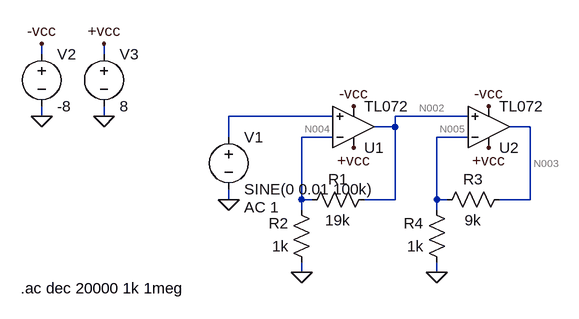
[diagram p0: schematic Bandwidth_OpAmp.asc]
Bandwidth_OpAmp.asc, the LTspice schematic file:
Version 4
SHEET 1 880 680
WIRE -160 0 -160 -16
WIRE -64 0 -64 -16
WIRE -160 96 -160 80
WIRE -64 96 -64 80
WIRE 288 96 128 96
WIRE 496 96 384 96
WIRE 384 112 384 96
WIRE 384 112 352 112
WIRE 592 112 560 112
WIRE 128 128 128 96
WIRE 288 128 240 128
WIRE 496 128 448 128
WIRE 128 224 128 208
WIRE 240 224 240 128
WIRE 256 224 240 224
WIRE 384 224 384 112
WIRE 384 224 336 224
WIRE 448 224 448 128
WIRE 464 224 448 224
WIRE 592 224 592 112
WIRE 592 224 544 224
WIRE 240 240 240 224
WIRE 448 240 448 224
WIRE 240 336 240 320
WIRE 448 336 448 320
FLAG 240 336 0
FLAG 128 224 0
FLAG -160 96 0
FLAG -64 96 0
FLAG -64 -16 +vcc
FLAG 320 144 +vcc
FLAG 320 80 -vcc
FLAG -160 -16 -vcc
FLAG 448 336 0
FLAG 528 144 +vcc
FLAG 528 80 -vcc
SYMBOL voltage 128 112 R0
WINDOW 123 24 124 Left 2
WINDOW 39 0 0 Left 0
SYMATTR Value2 AC 1
SYMATTR InstName V1
SYMATTR Value SINE(0 0.01 100k)
SYMBOL OpAmps\\TL072 320 176 M180
SYMATTR InstName U1
SYMBOL res 352 208 R90
WINDOW 0 0 56 VBottom 2
WINDOW 3 32 56 VTop 2
SYMATTR InstName R1
SYMATTR Value 19k
SYMBOL res 256 336 R180
WINDOW 0 36 76 Left 2
WINDOW 3 36 40 Left 2
SYMATTR InstName R2
SYMATTR Value 1k
SYMBOL voltage -160 -16 R0
WINDOW 123 0 0 Left 0
WINDOW 39 0 0 Left 0
SYMATTR InstName V2
SYMATTR Value -8
SYMBOL voltage -64 -16 R0
WINDOW 123 0 0 Left 0
WINDOW 39 0 0 Left 0
SYMATTR InstName V3
SYMATTR Value 8
SYMBOL OpAmps\\TL072 528 176 M180
SYMATTR InstName U2
SYMBOL res 560 208 R90
WINDOW 0 0 56 VBottom 2
WINDOW 3 32 56 VTop 2
SYMATTR InstName R3
SYMATTR Value 9k
SYMBOL res 464 336 R180
WINDOW 0 36 76 Left 2
WINDOW 3 36 40 Left 2
SYMATTR InstName R4
SYMATTR Value 1k
TEXT -192 360 Left 2 !.ac dec 20000 1k 1meg

The netlist it stands for:
* Bandwidth_OpAmp.asc
V1 N001 0 SINE(0 0.01 100k) AC 1
XU1 N001 N004 +vcc -vcc N002 TL072  ; pins In+ In- V+ V- OUT
R1 N002 N004 19k
R2 0 N004 1k
V2 -vcc 0 -8
V3 +vcc 0 8
XU2 N002 N005 +vcc -vcc N003 TL072  ; pins In+ In- V+ V- OUT
R3 N003 N005 9k
R4 0 N005 1k
.ac dec 20000 1k 1meg
.backanno
.end

* Results of the author's LTspice run, read from the files saved beside the schematic
* Operating Point, zero values left out:
*   V(n002) = 220.1 µV
*   V(-vcc) = -8 V
*   V(+vcc) = 8 V
*   V(n004) = 10.97 µV
*   V(n003) = 2.311 mV
*   V(n005) = 231.1 µV
*   I(R4) = -231.1 nA
*   I(R3) = 231.1 nA
*   I(R2) = -10.97 nA
*   I(R1) = 11.01 nA
*   I(V3) = -15.32 mA
*   I(V2) = 15.32 mA
*   I(V1) = -38.05 pA
*   Ix(u1:1) = 38.05 pA
*   Ix(u1:2) = 38.05 pA
*   Ix(u1:3) = 7.661 mA
*   Ix(u1:4) = -7.662 mA
*   Ix(u1:5) = -11.05 nA
*   Ix(u2:1) = 38.05 pA
*   Ix(u2:2) = 38.05 pA
*   Ix(u2:3) = 7.661 mA
*   Ix(u2:4) = -7.662 mA
*   Ix(u2:5) = -231.1 nA